# EAGLE design Cartridge_Relocator_rev1 (EAGLE 9.7.0)
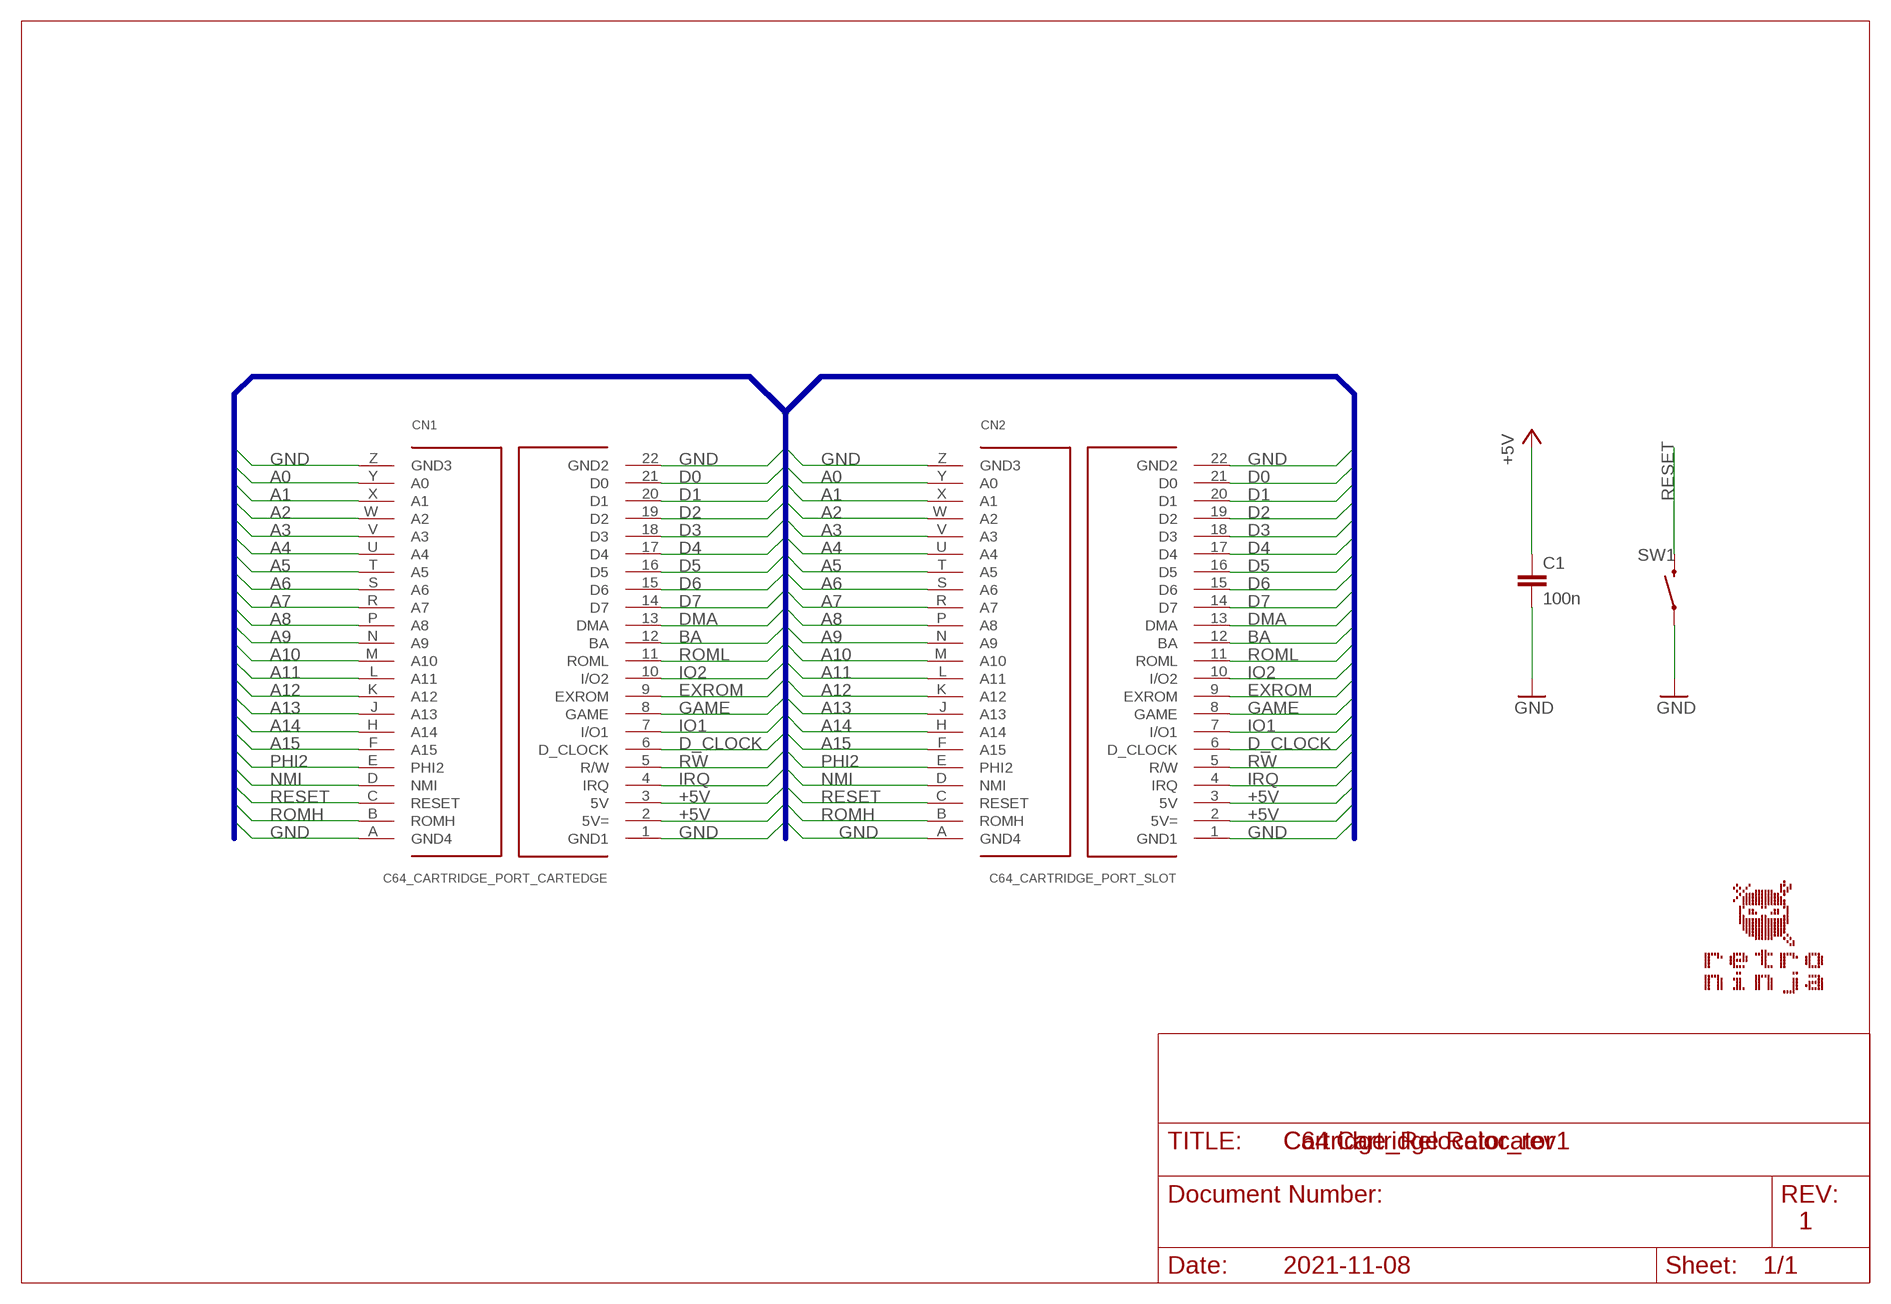
[diagram p0: schematic, sheet 1]

## Parts
C1  100n  CAPACITOR-5  [CAP_5MM_2.5X5.0_ROUND]
CN1  C64_CARTRIDGE_PORT_CARTEDGE  [C64_CARTRIDGE_BOARDEDGE]
CN2  C64_CARTRIDGE_PORT_SLOT  [C64_CARTRIDGE_SLOT]
SW1  SWITCH_MOMENTARY  [SWITCH_MOM_6.0MMX5.0MM]

## Nets
+5V: C1.1 CN1.2(5V=) CN1.3(5V) CN2.2(5V=) CN2.3(5V)
A0: CN1.Y(A0) CN2.Y(A0)
A1: CN1.X(A1) CN2.X(A1)
A2: CN1.W(A2) CN2.W(A2)
A3: CN1.V(A3) CN2.V(A3)
A4: CN1.U(A4) CN2.U(A4)
A5: CN1.T(A5) CN2.T(A5)
A6: CN1.S(A6) CN2.S(A6)
A7: CN1.R(A7) CN2.R(A7)
A8: CN1.P(A8) CN2.P(A8)
A9: CN1.N(A9) CN2.N(A9)
A10: CN1.M(A10) CN2.M(A10)
A11: CN1.L(A11) CN2.L(A11)
A12: CN1.K(A12) CN2.K(A12)
A13: CN1.J(A13) CN2.J(A13)
A14: CN1.H(A14) CN2.H(A14)
A15: CN1.F(A15) CN2.F(A15)
BA: CN1.12(BA) CN2.12(BA)
D0: CN1.21(D0) CN2.21(D0)
D1: CN1.20(D1) CN2.20(D1)
D2: CN1.19(D2) CN2.19(D2)
D3: CN1.18(D3) CN2.18(D3)
D4: CN1.17(D4) CN2.17(D4)
D5: CN1.16(D5) CN2.16(D5)
D6: CN1.15(D6) CN2.15(D6)
D7: CN1.14(D7) CN2.14(D7)
D_CLOCK: CN1.6(D_CLOCK) CN2.6(D_CLOCK)
DMA: CN1.13(DMA) CN2.13(DMA)
EXROM: CN1.9(EXROM) CN2.9(EXROM)
GAME: CN1.8(GAME) CN2.8(GAME)
GND: C1.2 CN1.1(GND1) CN1.22(GND2) CN1.A(GND4) CN1.Z(GND3) CN2.1(GND1) CN2.22(GND2) CN2.A(GND4) CN2.Z(GND3) SW1.1 SW1.2
IO1: CN1.7(I/O1) CN2.7(I/O1)
IO2: CN1.10(I/O2) CN2.10(I/O2)
IRQ: CN1.4(IRQ) CN2.4(IRQ)
NMI: CN1.D(NMI) CN2.D(NMI)
PHI2: CN1.E(PHI2) CN2.E(PHI2)
RESET: CN1.C(RESET) CN2.C(RESET) SW1.3 SW1.4
ROMH: CN1.B(ROMH) CN2.B(ROMH)
ROML: CN1.11(ROML) CN2.11(ROML)
RW: CN1.5(R/W) CN2.5(R/W)

## Buses
CARTRIDGE_PORT:+5V,A[0..15],BA,D[0..7],D_CLOCK,DMA,EXROM,GAME,GND,IO1,IO2,IRQ,NMI,PHI2,RESET,ROMH,ROML,RW

## Notes on the sheet
- C64 Cartridge Relocator
- 1
- 2021-11-08

## Library data of the parts
C1 = Per (Fusion 360):CAPACITOR
CN1 CN2 = Per (Fusion 360):C64_CARTRIDGE_PORT
SW1 = Per (Fusion 360):SWITCH_MOMENTARY

## Board
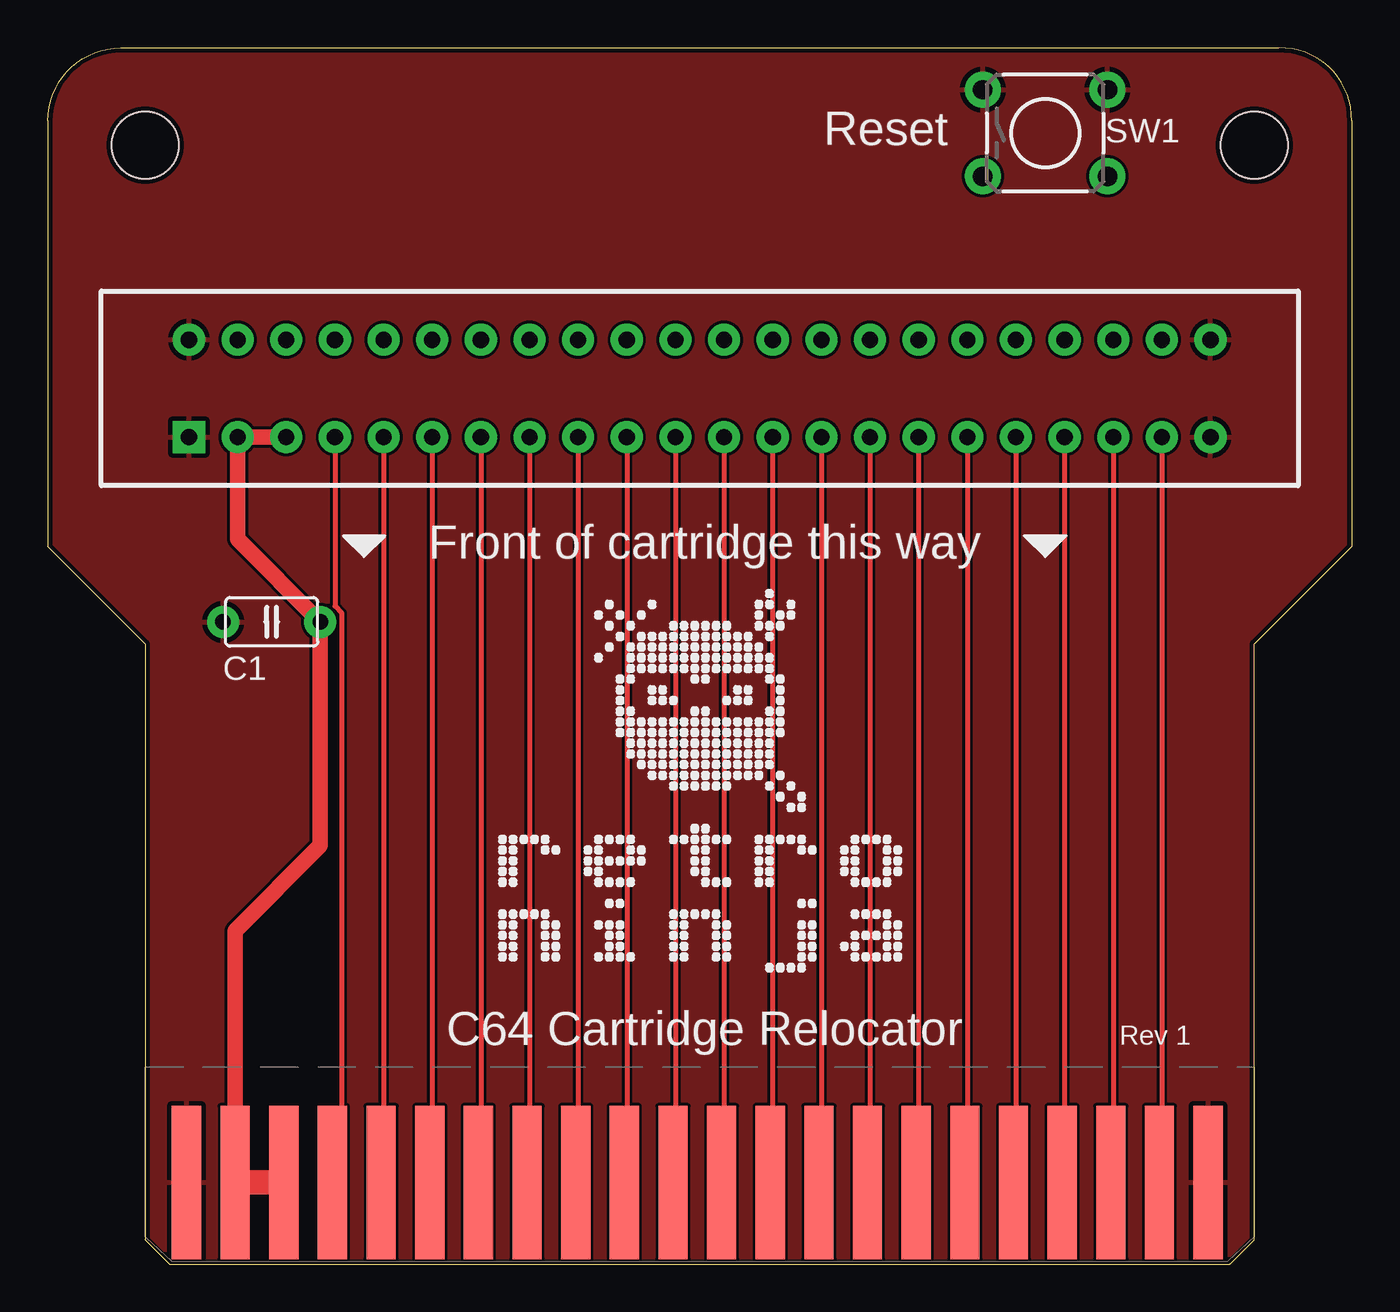
[diagram p1: board, top side]
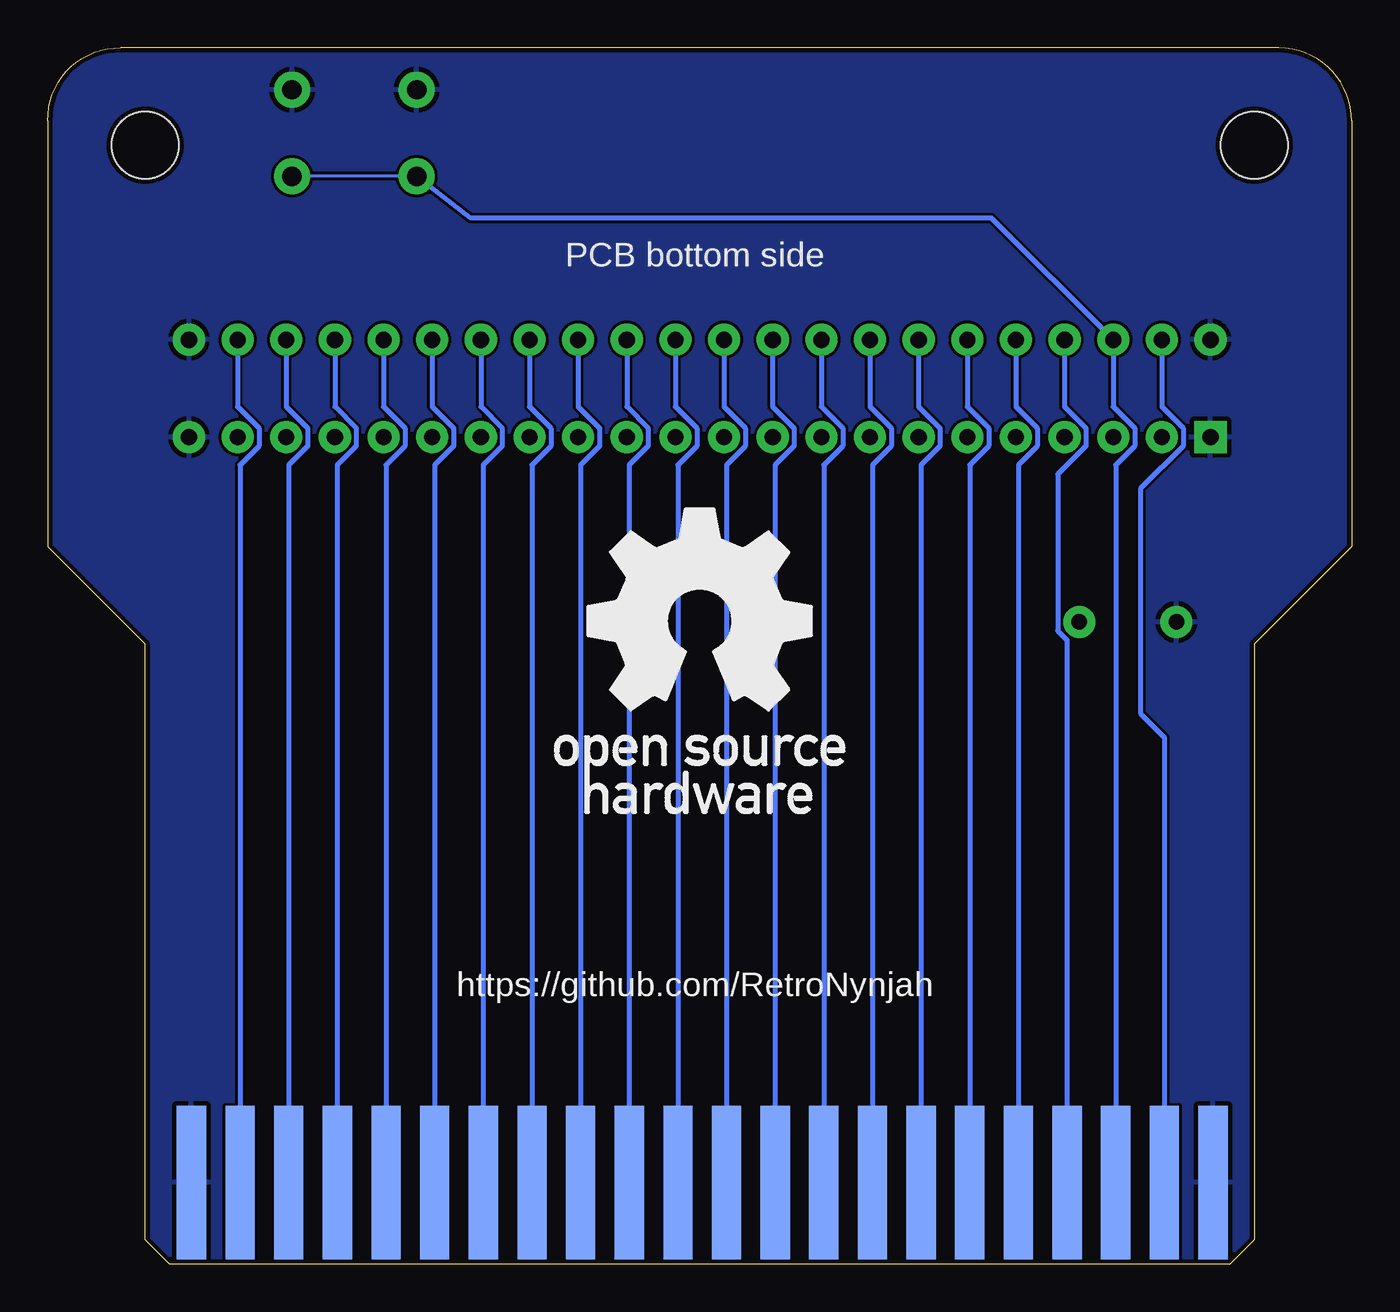
[diagram p2: board, bottom side, seen from below]

Size 68.07 x 63.5 mm. Coordinates in mm from the lower left corner, seen from the top.
Outline: 6.35,0 61.72,0 62.99,1.27 62.99,32.38 68.07,37.47 68.07,59.69 arc93 64.26,63.5 3.81,63.5 arc90 0,59.69 0,37.47 5.08,32.38 5.08,1.27 6.35,0
Copper layers (1*16): Top 0.035mm / dielectric 1.5mm / Bottom 0.035mm
Design rules "SeeedStudio_2layer_DRU_no_angle_20140221": minimum track width 6mil, minimum drill 12mil, track to track 6mil, track to pad 6mil, pad to pad 6mil, via to via 6mil, smd to smd 0mil, copper to edge 10mil, drill to drill 10mil, minimum pad ring 10mil, minimum via ring 6mil, stop-mask expansion 2mil, vias tented up to drill 100mil, thermal gap 10mil
Holes 3.5 mm at 62.99,58.42 5.08,58.42

### Footprints (pad centres in the part's own frame; a part is rotated, then mirrored left to right if it is on the bottom)
CAP_5MM_2.5X5.0_ROUND = drill 0.813 pad 1.676: 1 -2.54,0; 2 2.54,0
C64_CARTRIDGE_BOARDEDGE = smd 1.524 x 8.001: 1 2.159,4.115; 2 4.699,4.115; 3 7.239,4.115; 4 9.779,4.115; 5 12.319,4.115; 6 14.859,4.115; 7 17.399,4.115; 8 19.939,4.115; 9 22.479,4.115; 10 25.019,4.115; 11 27.559,4.115; 12 30.099,4.115; 13 32.639,4.115; 14 35.179,4.115; 15 37.719,4.115; 16 40.259,4.115; 17 42.799,4.115; 18 45.339,4.115; 19 47.879,4.115; 20 50.419,4.115; 21 52.959,4.115; 22 55.499,4.115 | smd 1.524 x 8.001 bottom: A 2.159,4.115; B 4.699,4.115; C 7.239,4.115; D 9.779,4.115; E 12.319,4.115; F 14.859,4.115; H 17.399,4.115; J 19.939,4.115; K 22.479,4.115; L 25.019,4.115; M 27.559,4.115; N 30.099,4.115; P 32.639,4.115; R 35.179,4.115; S 37.719,4.115; T 40.259,4.115; U 42.799,4.115; V 45.339,4.115; W 47.879,4.115; X 50.419,4.115; Y 52.959,4.115; Z 55.499,4.115
C64_CARTRIDGE_SLOT = drill 0.85 pad 1.676 square: 1 -26.67,-2.54 | drill 0.85 pad 1.676: 2 -24.13,-2.54; 3 -21.59,-2.54; 4 -19.05,-2.54; 5 -16.51,-2.54; 6 -13.97,-2.54; 7 -11.43,-2.54; 8 -8.89,-2.54; 9 -6.35,-2.54; 10 -3.81,-2.54; 11 -1.27,-2.54; 12 1.27,-2.54; 13 3.81,-2.54; 14 6.35,-2.54; 15 8.89,-2.54; 16 11.43,-2.54; 17 13.97,-2.54; 18 16.51,-2.54; 19 19.05,-2.54; 20 21.59,-2.54; 21 24.13,-2.54; 22 26.67,-2.54; A -26.67,2.54; B -24.13,2.54; C -21.59,2.54; D -19.05,2.54; E -16.51,2.54; F -13.97,2.54; H -11.43,2.54; J -8.89,2.54; K -6.35,2.54; L -3.81,2.54; M -1.27,2.54; N 1.27,2.54; P 3.81,2.54; R 6.35,2.54; S 8.89,2.54; T 11.43,2.54; U 13.97,2.54; V 16.51,2.54; W 19.05,2.54; X 21.59,2.54; Y 24.13,2.54; Z 26.67,2.54
SWITCH_MOM_6.0MMX5.0MM = drill 1.016 pad 1.88: 1 -3.251,2.261; 2 3.251,2.261; 3 -3.251,-2.261; 4 3.251,-2.261

### Placement (x,y rotation side)
C1  11.68,33.53 180 top
CN1  5.08,0.14 0 top
CN2  34.04,45.72 0 top
SW1  52.07,59.05 0 top
U$1  [RETRONINJA_20MM]  23.49,15.24 0 top
U$2  [OSHW_16MM]  41.66,23.5 0 bottom

### Tracks (layer width: path | path; a pad name or v marks a point on that pad's centre or on a via)
+5V
  Top 0.813: CN2.3 CN2.2 9.91,37.85 C1.1 14.22,21.84 9.78,17.4 CN1.2
  Top 1.27: CN1.2 CN1.3
A0
  Bottom 0.254: CN2.Y 58.17,44.76 57.05,43.64 57.05,42.72 58.04,41.73 CN1.Y
A1
  Bottom 0.254: CN2.X 55.63,44.76 54.51,43.64 54.51,42.72 55.5,41.73 CN1.X
A2
  Bottom 0.254: CN2.W 53.09,44.76 51.97,43.64 51.97,42.72 52.96,41.73 CN1.W
A3
  Bottom 0.254: CN2.V 50.55,44.76 49.43,43.64 49.43,42.72 50.42,41.73 CN1.V
A4
  Bottom 0.254: CN2.U 48.01,44.76 46.89,43.64 46.89,42.72 47.88,41.73 CN1.U
A5
  Bottom 0.254: CN2.T 45.47,44.76 44.35,43.64 44.35,42.72 45.34,41.73 CN1.T
A6
  Bottom 0.254: CN2.S 42.93,44.76 41.81,43.64 41.81,42.72 42.8,41.73 CN1.S
A7
  Bottom 0.254: CN2.R 40.39,44.76 39.27,43.64 39.27,42.72 40.26,41.73 CN1.R
A8
  Bottom 0.254: CN2.P 37.85,44.76 36.73,43.64 36.73,42.72 37.72,41.73 CN1.P
A9
  Bottom 0.254: CN2.N 35.31,44.76 34.19,43.64 34.19,42.72 35.18,41.73 CN1.N
A10
  Bottom 0.254: CN2.M 32.77,44.76 31.65,43.64 31.65,42.72 32.64,41.73 CN1.M
A11
  Bottom 0.254: CN2.L 30.23,44.76 29.11,43.64 29.11,42.72 30.1,41.73 CN1.L
A12
  Bottom 0.254: CN2.K 27.69,44.76 26.57,43.64 26.57,42.72 27.56,41.73 CN1.K
A13
  Bottom 0.254: CN2.J 25.15,44.76 24.03,43.64 24.03,42.72 25.02,41.73 CN1.J
A14
  Bottom 0.254: CN2.H 22.61,44.76 21.49,43.64 21.49,42.72 22.48,41.73 CN1.H
A15
  Bottom 0.254: CN2.F 20.07,44.76 18.95,43.64 18.95,42.72 19.94,41.73 CN1.F
BA
  Top 0.254: CN2.12 35.31,4.38 CN1.12
D0
  Top 0.254: CN2.21 58.17,4.38 CN1.21
D1
  Top 0.254: CN2.20 55.63,4.38 CN1.20
D2
  Top 0.254: CN2.19 53.09,4.38 CN1.19
D3
  Top 0.254: CN2.18 50.55,4.38 CN1.18
D4
  Top 0.254: CN2.17 48.01,4.38 CN1.17
D5
  Top 0.254: CN2.16 45.47,4.38 CN1.16
D6
  Top 0.254: CN2.15 42.93,4.38 CN1.15
D7
  Top 0.254: CN2.14 40.39,4.38 CN1.14
D_CLOCK
  Top 0.254: CN2.6 20.07,4.38 CN1.6
DMA
  Top 0.254: CN2.13 37.85,4.38 CN1.13
EXROM
  Top 0.254: CN2.9 27.69,4.38 CN1.9
GAME
  Top 0.254: CN2.8 25.15,4.38 CN1.8
GND
  pour Bottom: 5.19,32.46 5.21,32.41 5.21,1.32 6.4,0.13 61.67,0.13 62.86,1.32 62.86,32.41 62.88,32.46 67.95,37.52 67.95,59.69 67.92,60.18 67.84,60.65 67.69,61.12 67.48,61.55 67.21,61.96 66.89,62.32 66.53,62.64 66.12,62.91 65.69,63.12 65.23,63.27 64.75,63.35 64.26,63.37 3.81,63.37 3.29,63.34 2.77,63.22 2.28,63.04 1.82,62.79 1.4,62.47 1.03,62.1 0.71,61.68 0.46,61.22 0.28,60.73 0.16,60.21 0.13,59.69 0.13,37.52
  pour Top: 5.19,32.46 5.21,32.41 5.21,1.32 6.4,0.13 61.67,0.13 62.86,1.32 62.86,32.41 62.88,32.46 67.95,37.52 67.95,59.69 67.92,60.18 67.84,60.65 67.69,61.12 67.48,61.55 67.21,61.96 66.89,62.32 66.53,62.64 66.12,62.91 65.69,63.12 65.23,63.27 64.75,63.35 64.26,63.37 3.81,63.37 3.29,63.34 2.77,63.22 2.28,63.04 1.82,62.79 1.4,62.47 1.03,62.1 0.71,61.68 0.46,61.22 0.28,60.73 0.16,60.21 0.13,59.69 0.13,37.52
IO1
  Top 0.254: CN2.7 22.61,4.38 CN1.7
IO2
  Top 0.254: CN2.10 30.23,4.38 CN1.10
IRQ
  Top 0.254: CN2.4 14.99,34.35 15.34,33.99 15.34,4.74 CN1.4
NMI
  Bottom 0.254: CN2.D 14.99,44.76 13.87,43.64 13.87,42.72 15.34,41.24 15.34,33.06 14.86,32.58 CN1.D
PHI2
  Bottom 0.254: CN2.E 17.53,44.76 16.41,43.64 16.41,42.72 17.4,41.73 CN1.E
RESET
  Bottom 0.152: SW1.3 SW1.4
  Bottom 0.254: SW1.3 46,54.61 18.8,54.61 CN2.C 12.45,44.76 11.33,43.64 11.33,42.72 12.32,41.73 CN1.C
ROMH
  Bottom 0.254: CN2.B 9.91,44.76 8.79,43.64 8.79,42.72 11.02,40.48 11.02,28.75 9.78,27.5 CN1.B
ROML
  Top 0.254: CN2.11 32.77,4.38 CN1.11
RW
  Top 0.254: CN2.5 17.53,4.38 CN1.5

### Text on the board
tPlace: Reset | Front of cartridge this way | C64 Cartridge Relocator | Rev 1
bPlace: PCB bottom side | https://github.com/RetroNynjah